# EAGLE design pir (EAGLE 9.6.2)
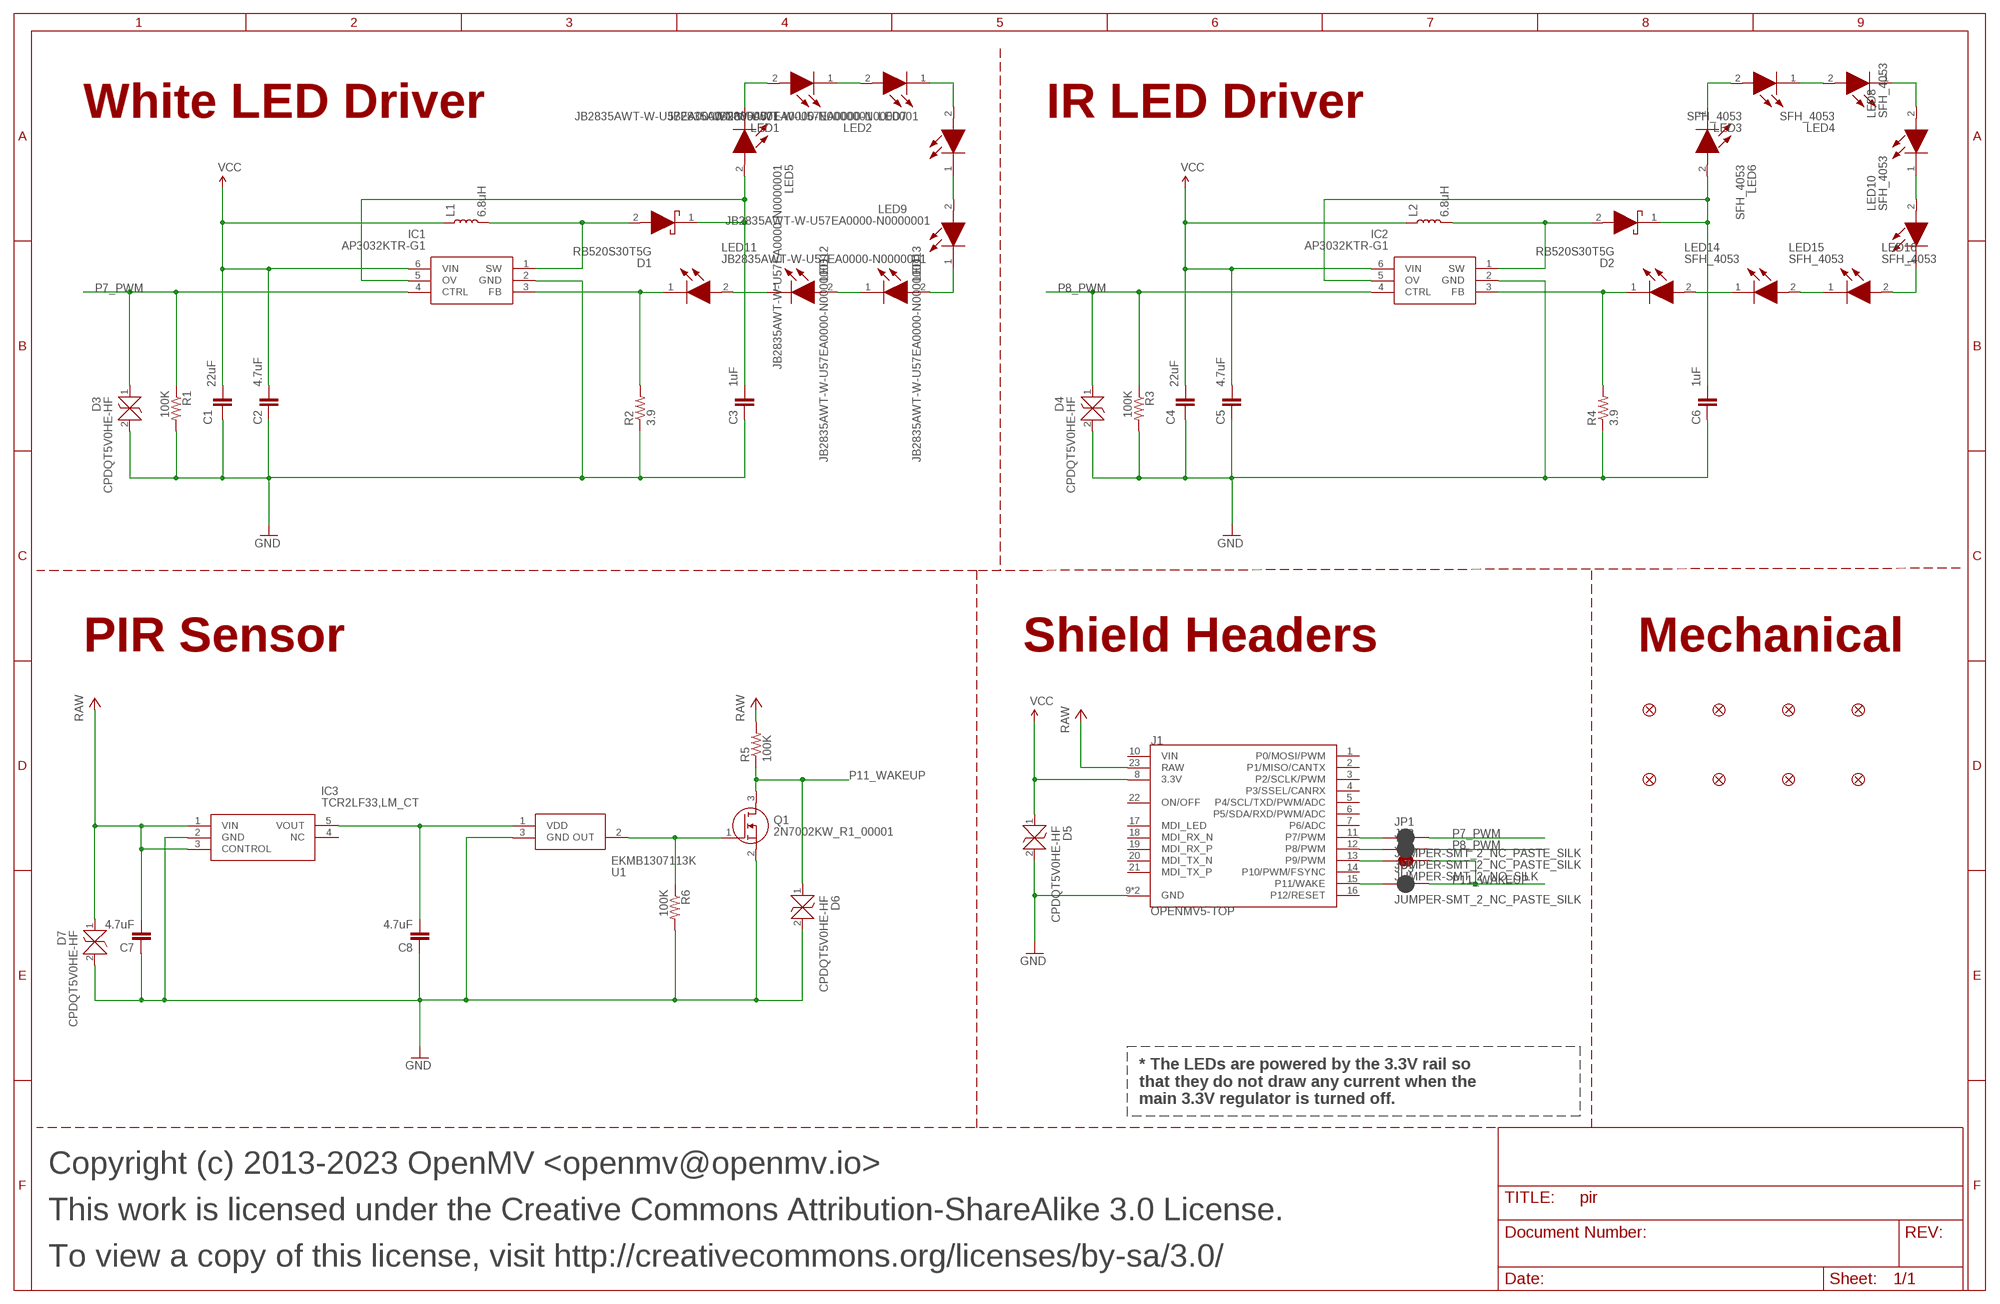
[diagram p0: schematic, sheet 1]

## Parts
C1  22uF  22UF-0805-6.3V-20%  [0805]
C2  4.7uF  CAP0402-CAP  [0402-CAP]
C3  1uF  CAP0402-CAP  [0402-CAP]
C4  22uF  22UF-0805-6.3V-20%  [0805]
C5  4.7uF  CAP0402-CAP  [0402-CAP]
C6  1uF  CAP0402-CAP  [0402-CAP]
C7  4.7uF  CAP0402-CAP  [0402-CAP]
C8  4.7uF  CAP0402-CAP  [0402-CAP]
D1  RB520S30T5G  [SODFL1608X70N]
D2  RB520S30T5G  [SODFL1608X70N]
D3  CPDQT5V0HE-HF  [CPDQT5V0HEHF]
D4  CPDQT5V0HE-HF  [CPDQT5V0HEHF]
D5  CPDQT5V0HE-HF  [CPDQT5V0HEHF]
D6  CPDQT5V0HE-HF  [CPDQT5V0HEHF]
D7  CPDQT5V0HE-HF  [CPDQT5V0HEHF]
FD1  FIDUCIAL1X2  [FIDUCIAL-1X2]
FD2  FIDUCIAL1X2  [FIDUCIAL-1X2]
FD3  FIDUCIAL1X2  [FIDUCIAL-1X2]
FD4  FIDUCIAL1X2  [FIDUCIAL-1X2]
FD5  FIDUCIAL1X2  [FIDUCIAL-1X2]
FD6  FIDUCIAL1X2  [FIDUCIAL-1X2]
FD7  FIDUCIAL1X2  [FIDUCIAL-1X2]
FD8  FIDUCIAL1X2  [FIDUCIAL-1X2]
IC1  AP3032KTR-G1  [SOT95P280X145-6N]
IC2  AP3032KTR-G1  [SOT95P280X145-6N]
IC3  TCR2LF33,LM_CT  [TCR2LF33LMCT]
J1  OPENMV5-TOP  [OPENMV5-TOP]
JP1  JUMPER-SMT_2_NC_PASTE_SILK  [SMT-JUMPER_2_NC_PASTE_SILK]
JP2  JUMPER-SMT_2_NC_PASTE_SILK  [SMT-JUMPER_2_NC_PASTE_SILK]
JP3  JUMPER-SMT_2_NC_PASTE_SILK  [SMT-JUMPER_2_NC_PASTE_SILK]
JP4  JUMPER-SMT_2_NO_SILK  [SMT-JUMPER_2_NO_SILK]
L1  6.8uH  INDUCTOR-0805-3.3UH  [0805]
L2  6.8uH  INDUCTOR-0805-3.3UH  [0805]
LED1  JB2835AWT-W-U57EA0000-N0000001  [JB2835AWTWU57EA0000N0000001]
LED2  JB2835AWT-W-U57EA0000-N0000001  [JB2835AWTWU57EA0000N0000001]
LED3  SFH_4053  [LEDC1005X55N]
LED4  SFH_4053  [LEDC1005X55N]
LED5  JB2835AWT-W-U57EA0000-N0000001  [JB2835AWTWU57EA0000N0000001]
LED6  SFH_4053  [LEDC1005X55N]
LED7  JB2835AWT-W-U57EA0000-N0000001  [JB2835AWTWU57EA0000N0000001]
LED8  SFH_4053  [LEDC1005X55N]
LED9  JB2835AWT-W-U57EA0000-N0000001  [JB2835AWTWU57EA0000N0000001]
LED10  SFH_4053  [LEDC1005X55N]
LED11  JB2835AWT-W-U57EA0000-N0000001  [JB2835AWTWU57EA0000N0000001]
LED12  JB2835AWT-W-U57EA0000-N0000001  [JB2835AWTWU57EA0000N0000001]
LED13  JB2835AWT-W-U57EA0000-N0000001  [JB2835AWTWU57EA0000N0000001]
LED14  SFH_4053  [LEDC1005X55N]
LED15  SFH_4053  [LEDC1005X55N]
LED16  SFH_4053  [LEDC1005X55N]
Q1  2N7002KW_R1_00001  [SOT65P210X110-3N]
R1  100K  RESISTOR0402-RES  [0402-RES]
R2  3.9  R-US_R2512  [R2512]
R3  100K  RESISTOR0402-RES  [0402-RES]
R4  3.9  R-US_R2512  [R2512]
R5  100K  RESISTOR0402-RES  [0402-RES]
R6  100K  RESISTOR0402-RES  [0402-RES]
U1  EKMB1307113K  EKMB1304111K  [EKMB1304111K]

## Nets
GND [gnd]: C1.1 C2.1 C3.1 C4.1 C5.1 C6.1 C7.1 C8.1 D3.2 D4.2 D5.2 D6.2 D7.2 IC1.2(GND) IC2.2(GND) IC3.2(GND) J1.9(GND) J1.24(GND) Q1.2(S) R1.2 R2.1 R3.2 R4.1 R6.2 U1.3(GND)
I1 [led]: LED3.2(A) LED6.1(K)
I2 [led]: LED3.1(K) LED4.2(A)
I3 [led]: LED4.1(K) LED8.2(A)
I4 [led]: LED8.1(K) LED10.2(A)
I5 [led]: LED10.1(K) LED16.2(A)
I6 [led]: LED15.2(A) LED16.1(K)
I7 [led]: LED14.2(A) LED15.1(K)
IFB [pwr]: IC2.3(FB) LED14.1(K) R4.2
IOV [pwr]: C6.2 D2.1(K) IC2.5(OV) LED6.2(A)
ISW [pwr]: D2.2(A) IC2.1(SW) L2.2
OUT [signal]: Q1.1(G) R6.1 U1.2(OUT)
P7_PWM [signal]: D3.1 IC1.4(CTRL) JP1.2 R1.1
P7_PWM_INT [signal]: J1.11(P7/PWM) JP1.1
P8_PWM [signal]: D4.1 IC2.4(CTRL) JP2.2 R3.1
P8_PWM_INT [signal]: J1.12(P8/PWM) JP2.1
P11_WAKEUP [signal]: D6.1 JP3.2 JP4.2 Q1.3(D) R5.1
P11_WAKEUP_INT [signal]: J1.15(P11/WAKE) JP3.1
P11_WAKEUP_INT_2 [signal]: J1.13(P9/PWM) JP4.1
RAW [pwr]: C7.2 D7.1 IC3.1(VIN) IC3.3(CONTROL) J1.23(RAW) R5.2
VCC [pwr]: C1.2 C2.2 C4.2 C5.2 D5.1 IC1.6(VIN) IC2.6(VIN) J1.8(3.3V) L1.1 L2.1
VDD [pwr]: C8.2 IC3.5(VOUT) U1.1(VDD)
W1 [led]: LED1.2(A) LED5.1(K)
W2 [led]: LED1.1(K) LED2.2(A)
W3 [led]: LED2.1(K) LED7.2(A)
W4 [led]: LED7.1(K) LED9.2(A)
W5 [led]: LED9.1(K) LED13.2(A)
W6 [led]: LED12.2(A) LED13.1(K)
W7 [led]: LED11.2(A) LED12.1(K)
WFB [pwr]: IC1.3(FB) LED11.1(K) R2.2
WOV [pwr]: C3.2 D1.1(K) IC1.5(OV) LED5.2(A)
WSW [pwr]: D1.2(A) IC1.1(SW) L1.2
Unconnected: IC3.4(NC) J1.1(P0/MOSI/PWM) J1.2(P1/MISO/CANTX) J1.3(P2/SCLK/PWM) J1.4(P3/SSEL/CANRX) J1.5(P4/SCL/TXD/PWM/ADC) J1.6(P5/SDA/RXD/PWM/ADC) J1.7(P6/ADC) J1.10(VIN) J1.14(P10/PWM/FSYNC) J1.16(P12/RESET) J1.17(MDI_LED) J1.18(MDI_RX_N) J1.19(MDI_RX_P) J1.20(MDI_TX_N) J1.21(MDI_TX_P) J1.22(ON/OFF)

## Notes on the sheet
- White LED Driver | IR LED Driver
- PIR Sensor | Shield Headers | Mechanical
- * The LEDs are powered by the 3.3V rail so
  that they do not draw any current when the
  main 3.3V regulator is turned off.
- Copyright (c) 2013-2023 OpenMV <openmv@openmv.io>
- This work is licensed under the Creative Commons Attribution-ShareAlike 3.0 License.
- To view a copy of this license, visit http://creativecommons.org/licenses/by-sa/3.0/

## Library data of the parts
C1 C4 = SparkFun-Capacitors:22UF: 22µF ceramic capacitors A capacitor is a passive two-terminal electrical component used to store electrical energy temporarily in an electric field.; MPN: CL21A226MQQNNNE; PROD_ID: CAP-08402
C2 C5 C7 C8 = sfe:CAP: Capacitor Standard 0603 ceramic capacitor, and 0.1" leaded capacitor.; MPN: JMK105BBJ475MV-F
C3 C6 = sfe:CAP: Capacitor Standard 0603 ceramic capacitor, and 0.1" leaded capacitor.; MPN: GRM155R6YA105KE11D
D1 D2 = RB520S30T5G:RB520S30T5G: Diode Schottky 30V 0.2A Automotive 2-Pin SOD-523 T/R Source: Datasheet <https://www.onsemi.com/pub/Collateral/RB520S30T1-D.PDF>; DESCRIPTION: Diode Schottky 30V 0.2A Automotive 2-Pin SOD-523 T/R; HEIGHT: 0.7mm; MANUFACTURER_NAME: onsemi; MANUFACTURER_PART_NUMBER: RB520S30T5G; MOUSER_PART_NUMBER: 863-RB520S30T5G; MOUSER_PRICE-STOCK: https://www.mouser.co.uk/ProductDetail/onsemi/RB520S30T5G?qs=M3GgpExcU29g6z8VWjIiaA%3D%3D; MPN: RB520S30T5G
D3-D7 = CPDQT5V0HE-HF:CPDQT5V0HE-HF: ESD Suppressors / TVS Diodes DIODE ESD 5VWM 65W 0402/SOD-923F Source: Datasheet <https://www.comchiptech.com/admin/files/product/CPDQT5V0HE-HF RevA.PDF>; DESCRIPTION: ESD Suppressors / TVS Diodes DIODE ESD 5VWM 65W 0402/SOD-923F; HEIGHT: 0.42mm; MANUFACTURER_NAME: Comchip Technology; MANUFACTURER_PART_NUMBER: CPDQT5V0HE-HF; MPN: CPDQT5V0HE-HF
FD1-FD8 = SparkFun-Aesthetics:FIDUCIAL: Fiducial Alignment Points Point-of-reference for pick-and-place machines and other optical instruments.
IC1 IC2 = AP3032KTR-G1:AP3032KTR-G1: DiodesZetex AP3032KTR-G1, Step Up DC-DC Converter, Adjustable, Maximum of 38 V, 6-Pin SOT-23 Source: Datasheet <https://www.diodes.com/assets/Datasheets/AP3032.pdf>; DESCRIPTION: DiodesZetex AP3032KTR-G1, Step Up DC-DC Converter, Adjustable, Maximum of 38 V, 6-Pin SOT-23; HEIGHT: 1.45mm; MANUFACTURER_NAME: Diodes Inc.; MANUFACTURER_PART_NUMBER: AP3032KTR-G1; MOUSER_PART_NUMBER: 621-AP3032KTR-G1; MOUSER_PRICE-STOCK: https://www.mouser.co.uk/ProductDetail/Diodes-Incorporated/AP3032KTR-G1?qs=x6A8l6qLYDBKP%252BiASla%2FZw%3D%3D; MPN: AP3032KTR-G1
IC3 = TCR2LF33_LM_CT:TCR2LF33,LM_CT: Linear Voltage Regulator IC Positive Fixed 1 Output 200mA SMV Source: Datasheet <https://www.mouser.es/datasheet/2/408/TCR2LF10_datasheet_en_20141106-760799.pdf>; DESCRIPTION: Linear Voltage Regulator IC Positive Fixed 1 Output 200mA SMV; HEIGHT: 1.4mm; MANUFACTURER_NAME: Toshiba; MANUFACTURER_PART_NUMBER: TCR2LF33,LM(CT; MOUSER_PART_NUMBER: 757-TCR2LF33LMCT; MOUSER_PRICE-STOCK: https://www.mouser.co.uk/ProductDetail/Toshiba/TCR2LF33LMCT?qs=lX6dEUlT%252BgfjY8NAoxAO5A%3D%3D; MPN: TCR2LF33,LM(CT
J1 = openmv5:OPENMV5-TOP
JP1-JP3 = SparkFun-Jumpers:JUMPER-SMT_2_NC_PASTE: Normally closed solder jumper This jumper has an aperture in the stencil to allow solder paste to bridge the split in the wire so it's normally closed (NC). Wick off the solder to open the connection. Reapply solder to reclose the connection.
JP4 = SparkFun-Jumpers:JUMPER-SMT_2_NO: Normally open jumper This jumper has two pads in close proximity to each other. Apply solder to close the connection. Round pads are easier to solder for beginners, but are a lot larger. SparkFun Product that uses the round pads: SparkFun EL Sequencer <https://www.sparkfun.com/products/12781>
L1 L2 = SparkFun-Coils:INDUCTOR: Inductors Resist changes in electrical current. Basically a coil of wire. SparkFun Products: SparkFun Load Cell Amplifier - HX711 <https://www.sparkfun.com/products/13879> IOIO-OTG - V2.2 <https://www.sparkfun.com/products/13613>; MPN: MLZ2012M6R8WT000; PROD_ID: NDUC-13076; VALUE: 3.3µH/±20%/450mA
LED1 LED2 LED5 LED7 LED9 LED11-LED13 = JB2835AWT-W-U57EA0000-N0000001:JB2835AWT-W-U57EA0000-N0000001: Mid-Power LEDs - White White 5700 K 90-CRI, 2835 Size, W Class Source: Datasheet <https://assets.cree-led.com/a/ds/j/JSeries-2835-3V-Consolidated.pdf>; DESCRIPTION: Mid-Power LEDs - White White 5700 K 90-CRI, 2835 Size, W Class; HEIGHT: 0.8mm; MANUFACTURER_NAME: Wolfspeed; MANUFACTURER_PART_NUMBER: JB2835AWT-W-U57EA0000-N0000001; MOUSER_PART_NUMBER: 941-JB2835AWTU57EAN; MOUSER_PRICE-STOCK: https://www.mouser.co.uk/ProductDetail/Cree-LED/JB2835AWT-W-U57EA0000-N0000001?qs=7MVldsJ5UaxVpdW62VaK8g%3D%3D; MPN: JB2835AWT-W-U57EA0000-N0000001
LED3 LED4 LED6 LED8 LED10 LED14-LED16 = SFH_4053:SFH_4053: IR Emitter,High Power,CHIPLED,850nm,140d Osram Opto SFH 4053 CHIPLED IR LED, 860nm, 0402 SMD package Source: Datasheet <https://datasheet.datasheetarchive.com/originals/distributors/DKDS41/DSANUWW0036892.pdf>; DESCRIPTION: IR Emitter,High Power,CHIPLED,850nm,140d Osram Opto SFH 4053 CHIPLED IR LED, 860nm, 0402 SMD package; HEIGHT: 0.55mm; MANUFACTURER_NAME: OSRAM; MANUFACTURER_PART_NUMBER: SFH 4053; MOUSER_PART_NUMBER: 720-SFH4053; MOUSER_PRICE-STOCK: https://www.mouser.co.uk/ProductDetail/OSRAM-Opto-Semiconductors/SFH-4053?qs=WFZtTl33IYKBVpRycaqUAw%3D%3D; MPN: SFH 4053
Q1 = 2N7002KW_R1_00001:2N7002KW_R1_00001: MOSFET 60V N-Channel Enhancement Mode MOSFET - ESD Protected Source: Datasheet <https://www.panjit.com.tw/upload/datasheet/2N7002KW.pdf>; DESCRIPTION: MOSFET 60V N-Channel Enhancement Mode MOSFET - ESD Protected; HEIGHT: 1.1mm; MANUFACTURER_NAME: PANJIT; MANUFACTURER_PART_NUMBER: 2N7002KW_R1_00001; MOUSER_PART_NUMBER: 241-2N7002KWR100001; MOUSER_PRICE-STOCK: https://www.mouser.co.uk/ProductDetail/Panjit/2N7002KW_R1_00001?qs=sPbYRqrBIVliWKATqv7jNA%3D%3D; MPN: 2N7002KW_R1_00001
R1 R3 R5 R6 = sfe:RESISTOR: Resistor Basic schematic elements and footprints for 0603, 1206, and PTH resistors.; MPN: AC0402FR-07100KL
R2 R4 = rcl:R-US_: RESISTOR, American symbol; MPN: 35203R9JT; SPICEPREFIX: R
U1 = EKMB1304111K:EKMB1304111K: Sensor PIR (Passive Infrared) 472" (12m) 39.4' Module Source: Datasheet <https://www.arrow.com/en/products/ekmb1304111k/panasonic>; DESCRIPTION: Sensor PIR (Passive Infrared) 472" (12m) 39.4' Module; HEIGHT: 20.7mm; MANUFACTURER_NAME: Panasonic; MANUFACTURER_PART_NUMBER: EKMB1304111K; MOUSER_PART_NUMBER: 769-EKMB1304111K; MOUSER_PRICE-STOCK: https://www.mouser.co.uk/ProductDetail/Panasonic-Industrial-Devices/EKMB1304111K?qs=gtWD0wcPNfNnxnKOQp2%252BgA%3D%3D; MPN: EKMB1307113K

## Net classes
0 default: width 0.127 mm, drill 0.254 mm, clearance 0.127 mm
1 led: width 0.127 mm, drill 0.254 mm, clearance 0.127 mm to class 0, clearance 0.127 mm
2 gnd: width 0.127 mm, drill 0.254 mm, clearance 0.127 mm to class 0, clearance 0.127 mm to class 1, clearance 0.127 mm
3 pwr: width 0.127 mm, drill 0.254 mm, clearance 0.127 mm to class 0, clearance 0.127 mm to class 1, clearance 0.127 mm to class 2, clearance 0.127 mm
4 signal: width 0.127 mm, drill 0.254 mm, clearance 0.127 mm to class 0, clearance 0.127 mm to class 1, clearance 0.127 mm to class 2, clearance 0.127 mm to class 3, clearance 0.127 mm

## Board
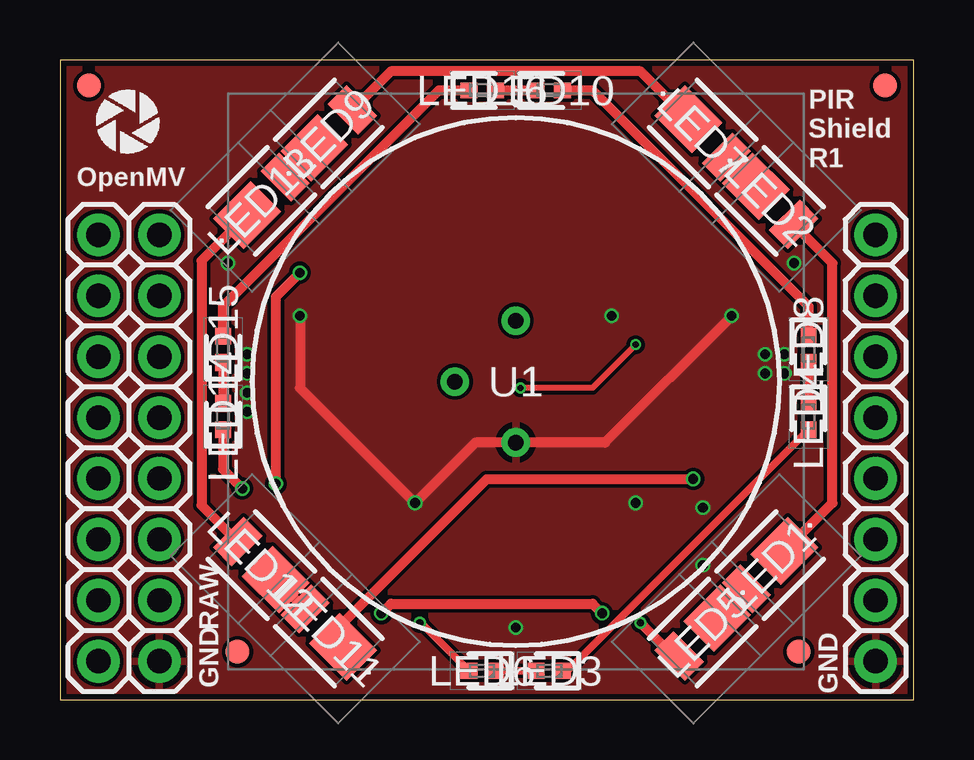
[diagram p1: board, top side]
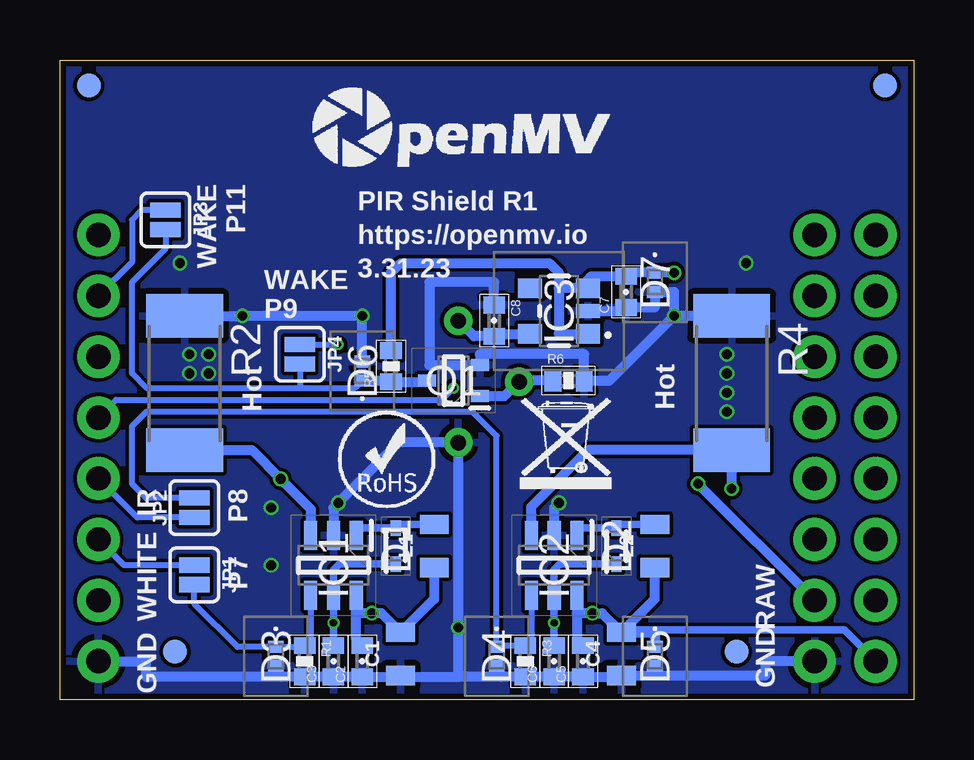
[diagram p2: board, bottom side, seen from below]

Size 35.6 x 26.67 mm. Coordinates in mm from the lower left corner, seen from the top.
Outline: 0,0 35.6,0 35.6,26.67 0,26.67 0,0
Copper layers (1*16): Top 0.035mm / dielectric 1.5mm / Bottom 0.035mm
Design rules "MF_Standard_2_Layer *": minimum track width 5mil, minimum drill 10mil, track to track 5mil, track to pad 5mil, pad to pad 5mil, via to via 5mil, smd to smd 0mil, copper to edge 10mil, drill to drill 10mil, minimum pad ring 4mil, minimum via ring 4mil, stop-mask expansion 2mil, vias tented up to drill 25mil, thermal gap 10mil

### Footprints (pad centres in the part's own frame; a part is rotated, then mirrored left to right if it is on the bottom)
0805 = smd 0.8 x 1.2: 1 -0.9,0; 2 0.9,0
0402-CAP = smd 0.7 x 0.9: 1 -0.65,0; 2 0.65,0
SODFL1608X70N = smd 0.64 x 0.42: 1 -0.75,0; 2 0.75,0
CPDQT5V0HEHF = smd 0.5 x 0.65: 1 -0.4,0; 2 0.4,0
FIDUCIAL-1X2 = smd 1 x 1: 1 0,0
SOT95P280X145-6N = smd 1.2 x 0.55: 1 -1.25,0.95; 2 -1.25,0; 3 -1.25,-0.95; 4 1.25,-0.95; 5 1.25,0; 6 1.25,0.95
TCR2LF33LMCT = smd 0.8 x 1: 1 -0.95,-1.2; 3 0.95,-1.2; 4 0.95,1.2; 5 -0.95,1.2 | smd 0.6 x 1: 2 0,-1.2
OPENMV5-TOP = drill 1.016 pad 1.778: 1 1.6,19.38; 2 1.6,16.84; 3 1.6,14.3; 4 1.6,11.76; 5 1.6,9.22; 6 1.6,6.68; 7 1.6,4.14; 8 1.6,1.6; 9 34,1.6; 10 34,4.14; 11 34,6.68; 12 34,9.22; 13 34,11.76; 14 34,14.3; 15 34,16.84; 16 34,19.38; 17 4.14,19.38; 18 4.14,16.84; 19 4.14,14.3; 20 4.14,11.76; 21 4.14,9.22; 22 4.14,6.68; 23 4.14,4.14; 24 4.14,1.6
SMT-JUMPER_2_NC_PASTE_SILK = smd 0.635 x 1.27: 1 -0.406,0; 2 0.406,0
SMT-JUMPER_2_NO_SILK = smd 0.635 x 1.27: 1 -0.406,0; 2 0.406,0
JB2835AWTWU57EA0000N0000001 = smd 2.2 x 1.8: 1 0.845,0 | smd 1.1 x 1.8: 2 -1.395,0
LEDC1005X55N = smd 0.7 x 0.65: 1 -0.55,0; 2 0.55,0
SOT65P210X110-3N = smd 0.75 x 0.5: 1 -1.1,0.65; 2 -1.1,-0.65; 3 1.1,0
0402-RES = smd 0.7 x 0.9: 1 -0.65,0; 2 0.65,0
R2512 = smd 1.8 x 3.2: 1 -2.8,0; 2 2.8,0
EKMB1304111K = drill 0.65 pad 1.192: 1 0,0; 2 2.54,2.54; 3 0,5.08

### Placement (x,y rotation side)
C1  21.4,1.9 90 bottom
C2  23,1.6 90 bottom
C3  24.2,1.6 90 bottom
C4  12.2,1.9 90 bottom
C5  13.8,1.6 90 bottom
C6  15,1.6 90 bottom
C7  12,17 90 bottom
C8  17.5,15.8 270 bottom
D1  21.6,6.4 90 bottom
D2  12.4,6.4 90 bottom
D3  26.6,1.8 270 bottom
D4  17.4,1.8 270 bottom
D5  10.8,1.8 270 bottom
D6  23,13.7 90 bottom
D7  10.8,17.4 270 bottom
FD1  7.4,2 0 top
FD2  30.8,2 0 top
FD3  34.4,25.6 0 top
FD4  1.2,25.6 0 top
FD5  7.4,2 0 bottom
FD6  30.8,2 0 bottom
FD7  34.4,25.6 0 bottom
FD8  1.2,25.6 0 bottom
IC1  24.2,5.6 270 bottom
IC2  15,5.6 270 bottom
IC3  14.8,16.2 90 bottom
J1  0,0 0 top
JP1  30,5.2 270 bottom
JP2  30,8 90 bottom
JP3  31.2,20 270 bottom
JP4  25.6,14.4 270 bottom
L1  20,6.4 90 bottom
L2  10.8,6.4 90 bottom
LED1  29.6,5.6 45 top
LED2  29.6,20.8 135 top
LED3  20.4,1.2 180 top
LED4  31.2,11.8 270 top
LED5  26.8,2.8 45 top
LED6  17.6,1.2 180 top
LED7  26.8,23.6 135 top
LED8  31.2,14.6 270 top
LED9  11.2,23.6 225 top
LED10  20.4,25.4 0 top
LED11  11.2,2.8 315 top
LED12  8.4,5.6 315 top
LED13  8.4,20.8 225 top
LED14  6.8,11.8 90 top
LED15  6.8,14.6 90 top
LED16  17.6,25.4 0 top
Q1  19.2,13.3 180 bottom
R1  25.4,1.6 270 bottom
R2  30.4,13.2 270 bottom
R3  16.2,1.6 270 bottom
R4  7.6,13.2 270 bottom
R5  21.8,13.9 90 bottom
R6  14.4,13.3 0 bottom
U1  19,15.8 180 top
U$1  [WEEE]  16.4,8.8 0 bottom
U$2  [ROHS]  24,8 0 bottom
U$3  [OMV-LOGO]  25.2,22 0 bottom
U$9  OPENMV-LOGO  [OPENMV-LOGO]  1.4,22.6 0 top

### Tracks (layer width: path | path; a pad name or v marks a point on that pad's centre or on a via)
GND  (via drill 0.41)
  Top 0.406: v10,16 10,13 v14.8,8.2 17.32,10.72 U1.3 22.72,10.72 v28,16
  Bottom 0.254: C7.1 12.15,16.5
  Bottom 0.406: J1.24 6.2,1.6 6.2,1 10.8,1 | 10.8,1 C4.1 12.25,0.95 C5.1 C6.1 R3.2 17.2,0.95 | J1.9 32,1.6 32,0.95 26.4,0.95 | 21.6,0.95 19,0.95 | C1.1 21.55,1 21.6,0.95 | 19,0.95 U1.3 21.48,10.72 v24,8.2 24.2,8 IC1.2 | 17.2,0.95 19,0.95 | D4.2 17.4,1.15 17.2,0.95 | 21.6,0.95 C2.1 C3.1 R1.2 26.4,0.95 | D3.2 26.6,1.15 26.4,0.95 | D5.2 10.8,1 | v14.8,8.2 15,8 IC2.2 | R4.1 v10,16 | R2.1 v28,16 v23,16 D6.2 | v10,16 12.7,13.3 R6.2 13.75,14.4 18.1,14.4 Q1.2 20.2,13.95 20.2,17.4 17.5,17.4 C8.1 | C7.1 11.95,16.4 | IC3.2 12.15,16.2 C7.1 | v10,16 10,17 D7.2 10.8,16.35 C7.1
  other vias: 26.8,5.6 26.8,8 19,3 7,18.2 30.6,18.2 7.8,14.4 7.8,13.6 7.8,12.8 7.8,12 30.2,14.4 30.2,13.6 29.4,13.6 29.4,14.4
  pour Bottom (isolate 0.152, rank 2): 0.2,0.2 35.4,0.2 35.4,26.6 0.2,26.6
  pour Top (isolate 0.152, rank 2): 0.1,0.1 35.5,0.1 35.5,26.7 0.1,26.7
I1
  Top 0.305: LED6.1 LED3.2
I2
  Top 0.305: LED4.2 21.15,1.2 LED3.1
I3
  Top 0.406: LED8.2 LED4.1
I4
  Top 0.406: LED10.2 22.2,25.4 31.2,16.4 LED8.1
I5
  Top 0.406: LED16.2 LED10.1
I6
  Top 0.406: LED15.2 6.8,16.4 15.8,25.4 LED16.1
I7
  Top 0.406: LED15.1 LED14.2
IFB  (via drill 0.41)
  Top 0.406: LED14.1 6.8,9.6 v7.6,8.8
  Bottom 0.406: IC2.3 15.95,8.05 13.6,10.4 R4.2 v7.6,8.8
IOV  (via drill 0.3)
  Top 0.305: v15,3.2 15.05,3.2 LED6.2
  Bottom 0.305: D2.1 14.75,5.65 15,5.4 IC2.5 v15,3.2 C6.2
ISW
  Bottom 0.305: IC2.1 14.05,7.15 D2.2 12.25,7.3 L2.2
OUT
  Bottom 0.406: R6.1 16.42,13.3 U1.2 17.07,12.65 Q1.1
P7_PWM
  Bottom 0.254: IC1.4 25.15,2.5 R1.1 25.45,2.2 D3.1 28.2,2.2 30,4 JP1.2
P7_PWM_INT
  Bottom 0.254: JP1.1 32.93,5.61 J1.11
P8_PWM
  Bottom 0.254: IC2.4 15.95,2.5 R3.1 17.35,2.25 D4.1 17.4,11 18.4,12 32,12 32.6,11.4 32.6,9 32.01,8.41 JP2.2
P8_PWM_INT
  Bottom 0.254: JP2.1 32.37,7.59 J1.12
P11_WAKEUP
  Bottom 0.254: 25.6,13 32,13 32.6,13.6 32.6,17.4 31.2,18.8 JP3.2 | 25.6,13 23.3,13 D6.1 | JP4.2 25.6,13
  Bottom 0.406: Q1.3 20.35,13.25 R5.1 21.85,13.3 D6.1
P11_WAKEUP_INT
  Bottom 0.254: JP3.1 32.19,20.41 32.6,20 32.6,18.24 J1.15
P11_WAKEUP_INT_2  (via drill 0.25)
  Top 0.254: v24,14.8 22.2,13 v19.2,13
  Bottom 0.254: J1.13 33.26,12.5 19.7,12.5 v19.2,13 | JP4.1 v24,14.8
RAW  (via drill 0.41)
  Top 0.406: v9,9 9,16.8 v10,17.8
  Bottom 0.254: 12.13,17.52 C7.2
  Bottom 0.406: v9,9 J1.23 | v10,17.8 D7.1 12.13,17.8 12.13,17.52 | 14.8,17.15 IC3.3 13.6,17.5 13.45,17.65 C7.2 | IC3.1 14.8,15.25 14.8,17.15 | R5.2 21.8,17.8 21.4,18.2 15.2,18.2 14.8,17.8 14.8,17.15
VCC  (via drill 0.41)
  Top 0.406: v13.4,3.6 13.8,4 22.2,4 v22.6,3.6
  Bottom 0.254: 12.2,2.9 C4.2
  Bottom 0.305: J1.8 2.9,2.9 12.2,2.9
  Bottom 0.406: IC2.6 14.05,3.6 | 14.05,3.6 14.05,2.5 C5.2 | C4.2 13,3.6 v13.4,3.6 14.05,3.6 | C4.2 10.8,4.2 L2.1 | L1.1 20,4.2 C1.2 22.2,3.6 v22.6,3.6 23.25,3.6 | C2.2 23.25,2.5 23.25,3.6 | 23.25,3.6 IC1.6 | C4.2 10.8,2.8 D5.1
VDD
  Bottom 0.406: IC3.5 17.4,15.25 C8.2 18.35,15.15 U1.1
W1
  Top 0.406: LED5.1 LED1.2
W2
  Top 0.406: LED1.1 32.2,8.2 32.2,18.2 LED2.2
W3
  Top 0.406: LED2.1 LED7.2
W4
  Top 0.406: LED7.1 24.2,26.2 13.8,26.2 LED9.2
W5
  Top 0.406: LED9.1 LED13.2
W6
  Top 0.406: LED13.1 5.9,18.3 5.9,8.1 LED12.2
W7
  Top 0.406: LED12.1 LED11.2
WFB  (via drill 0.41)
  Top 0.406: LED11.1 11.8,3.2 17.8,9.2 v26.4,9.2
  Bottom 0.406: R2.2 27.6,10.4 v26.4,9.2 26,8.8 25.15,7.95 IC1.3
WOV  (via drill 0.3)
  Top 0.406: v24.2,3.2 25.59,1.81 LED5.2
  Bottom 0.305: C3.2 v24.2,3.2 IC1.5 24.2,5.4 23.95,5.65 D1.1
WSW
  Bottom 0.305: L1.2 21.45,7.3 D1.2 23.25,7.15 IC1.1

### Text on the board
tPlace: PIR / Shield / R1 | OpenMV | RAW | GND | GND
bPlace: WAKE / P11 | PIR Shield R1 | https://openmv.io | 3.31.23 | WAKE / P9 | Hot | Hot | P8 | IR | WHITE | P7 | RAW | GND | GND